# EAGLE board ME461_F28379D (EAGLE 7.7.0), part 1 of 3
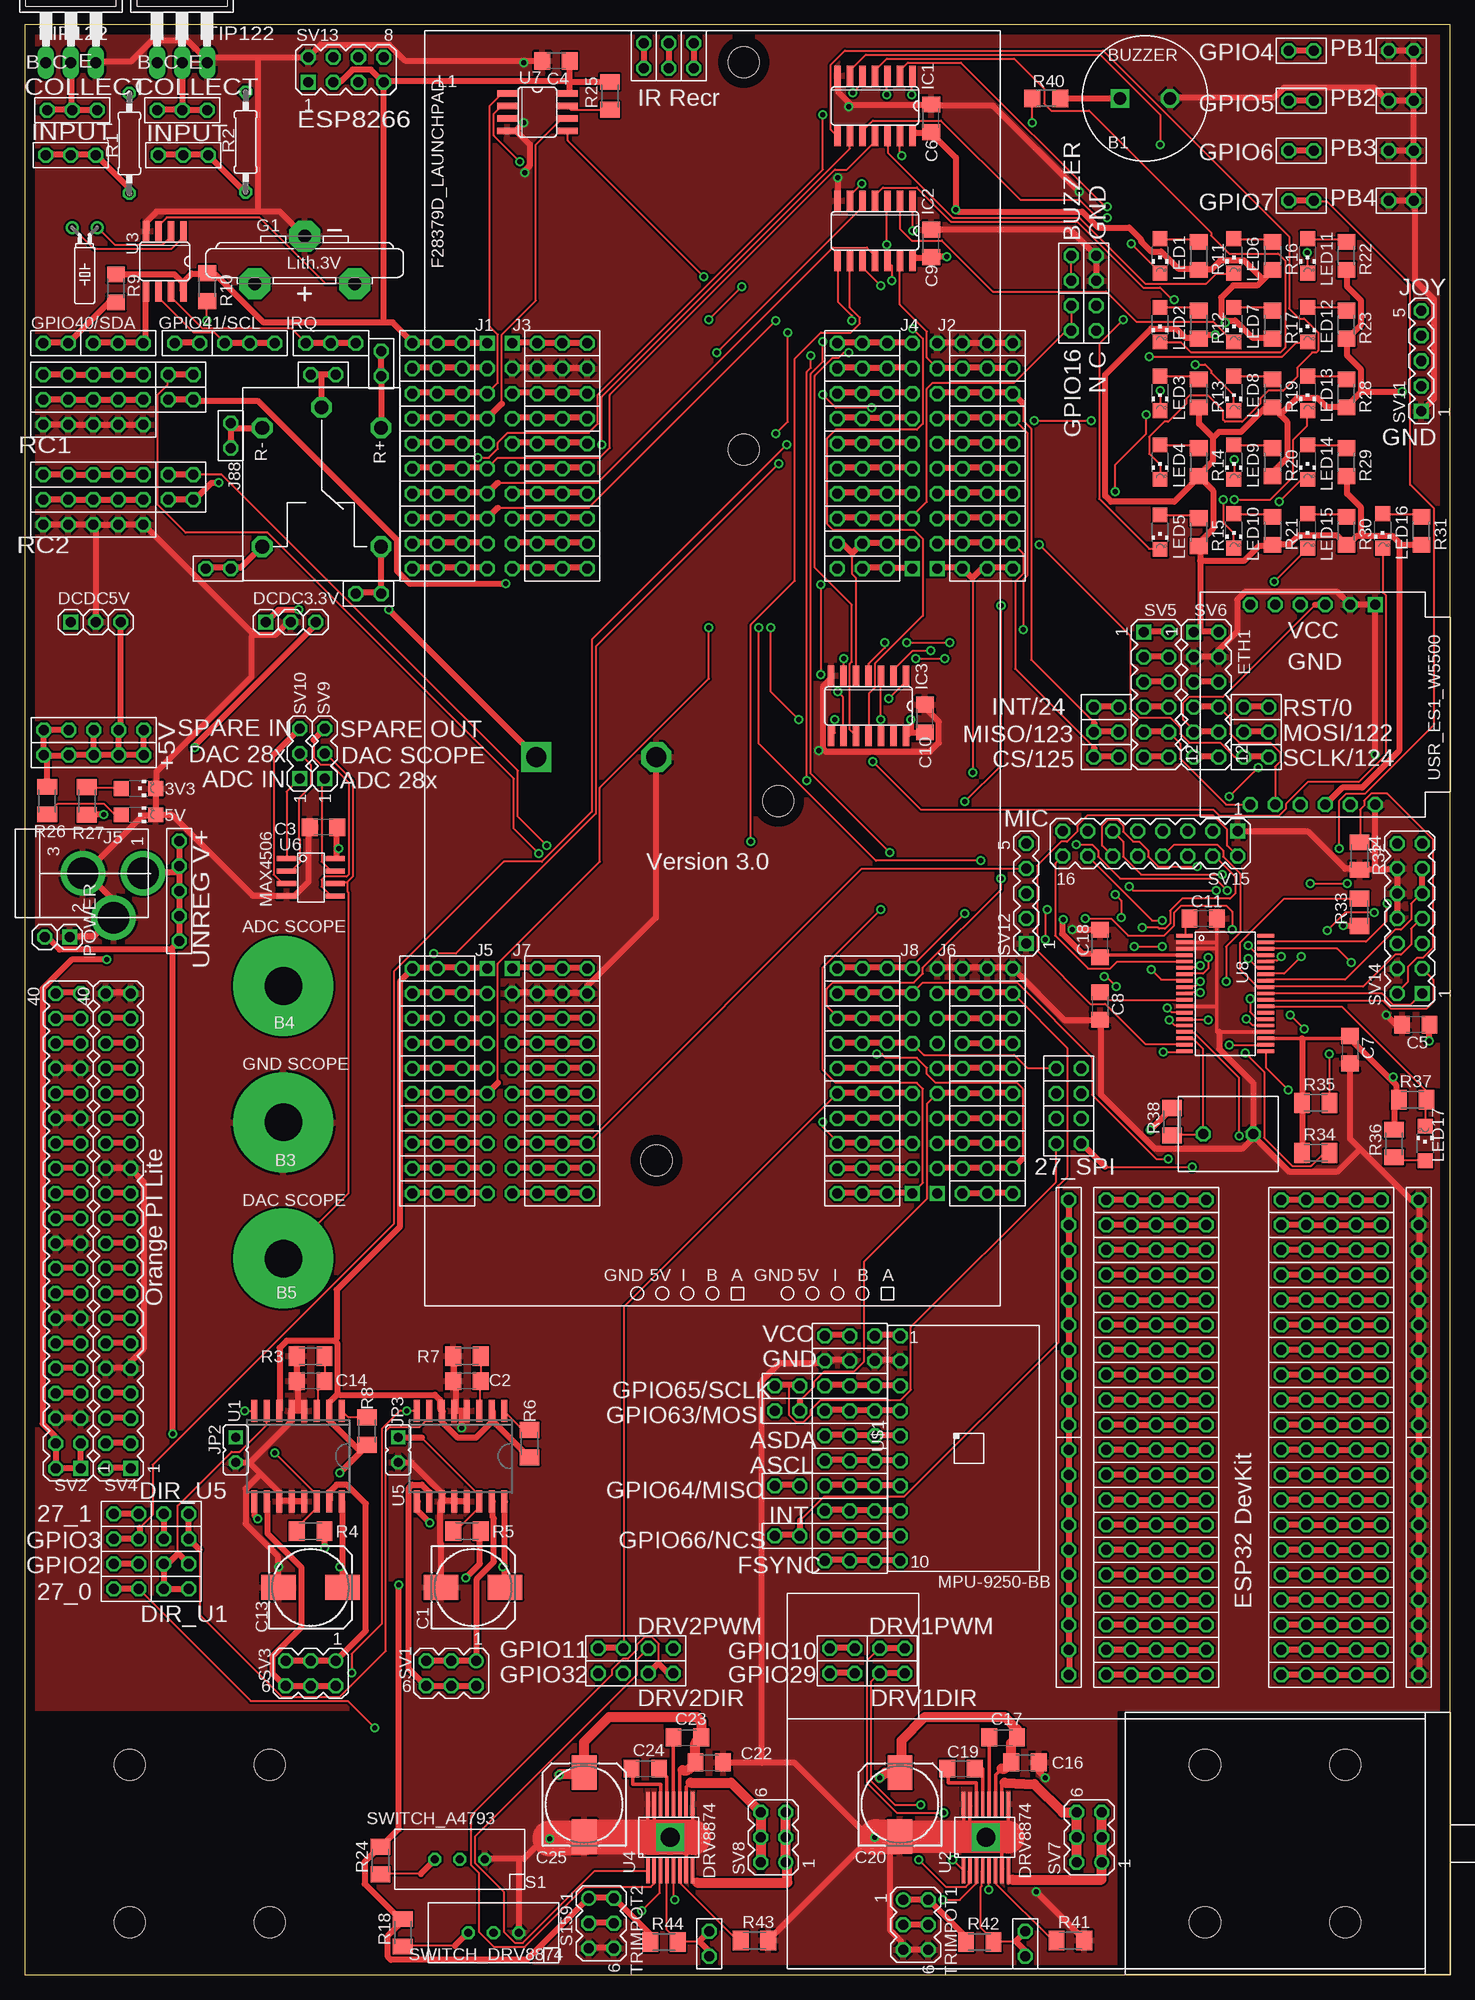
[diagram p5: board, top side]
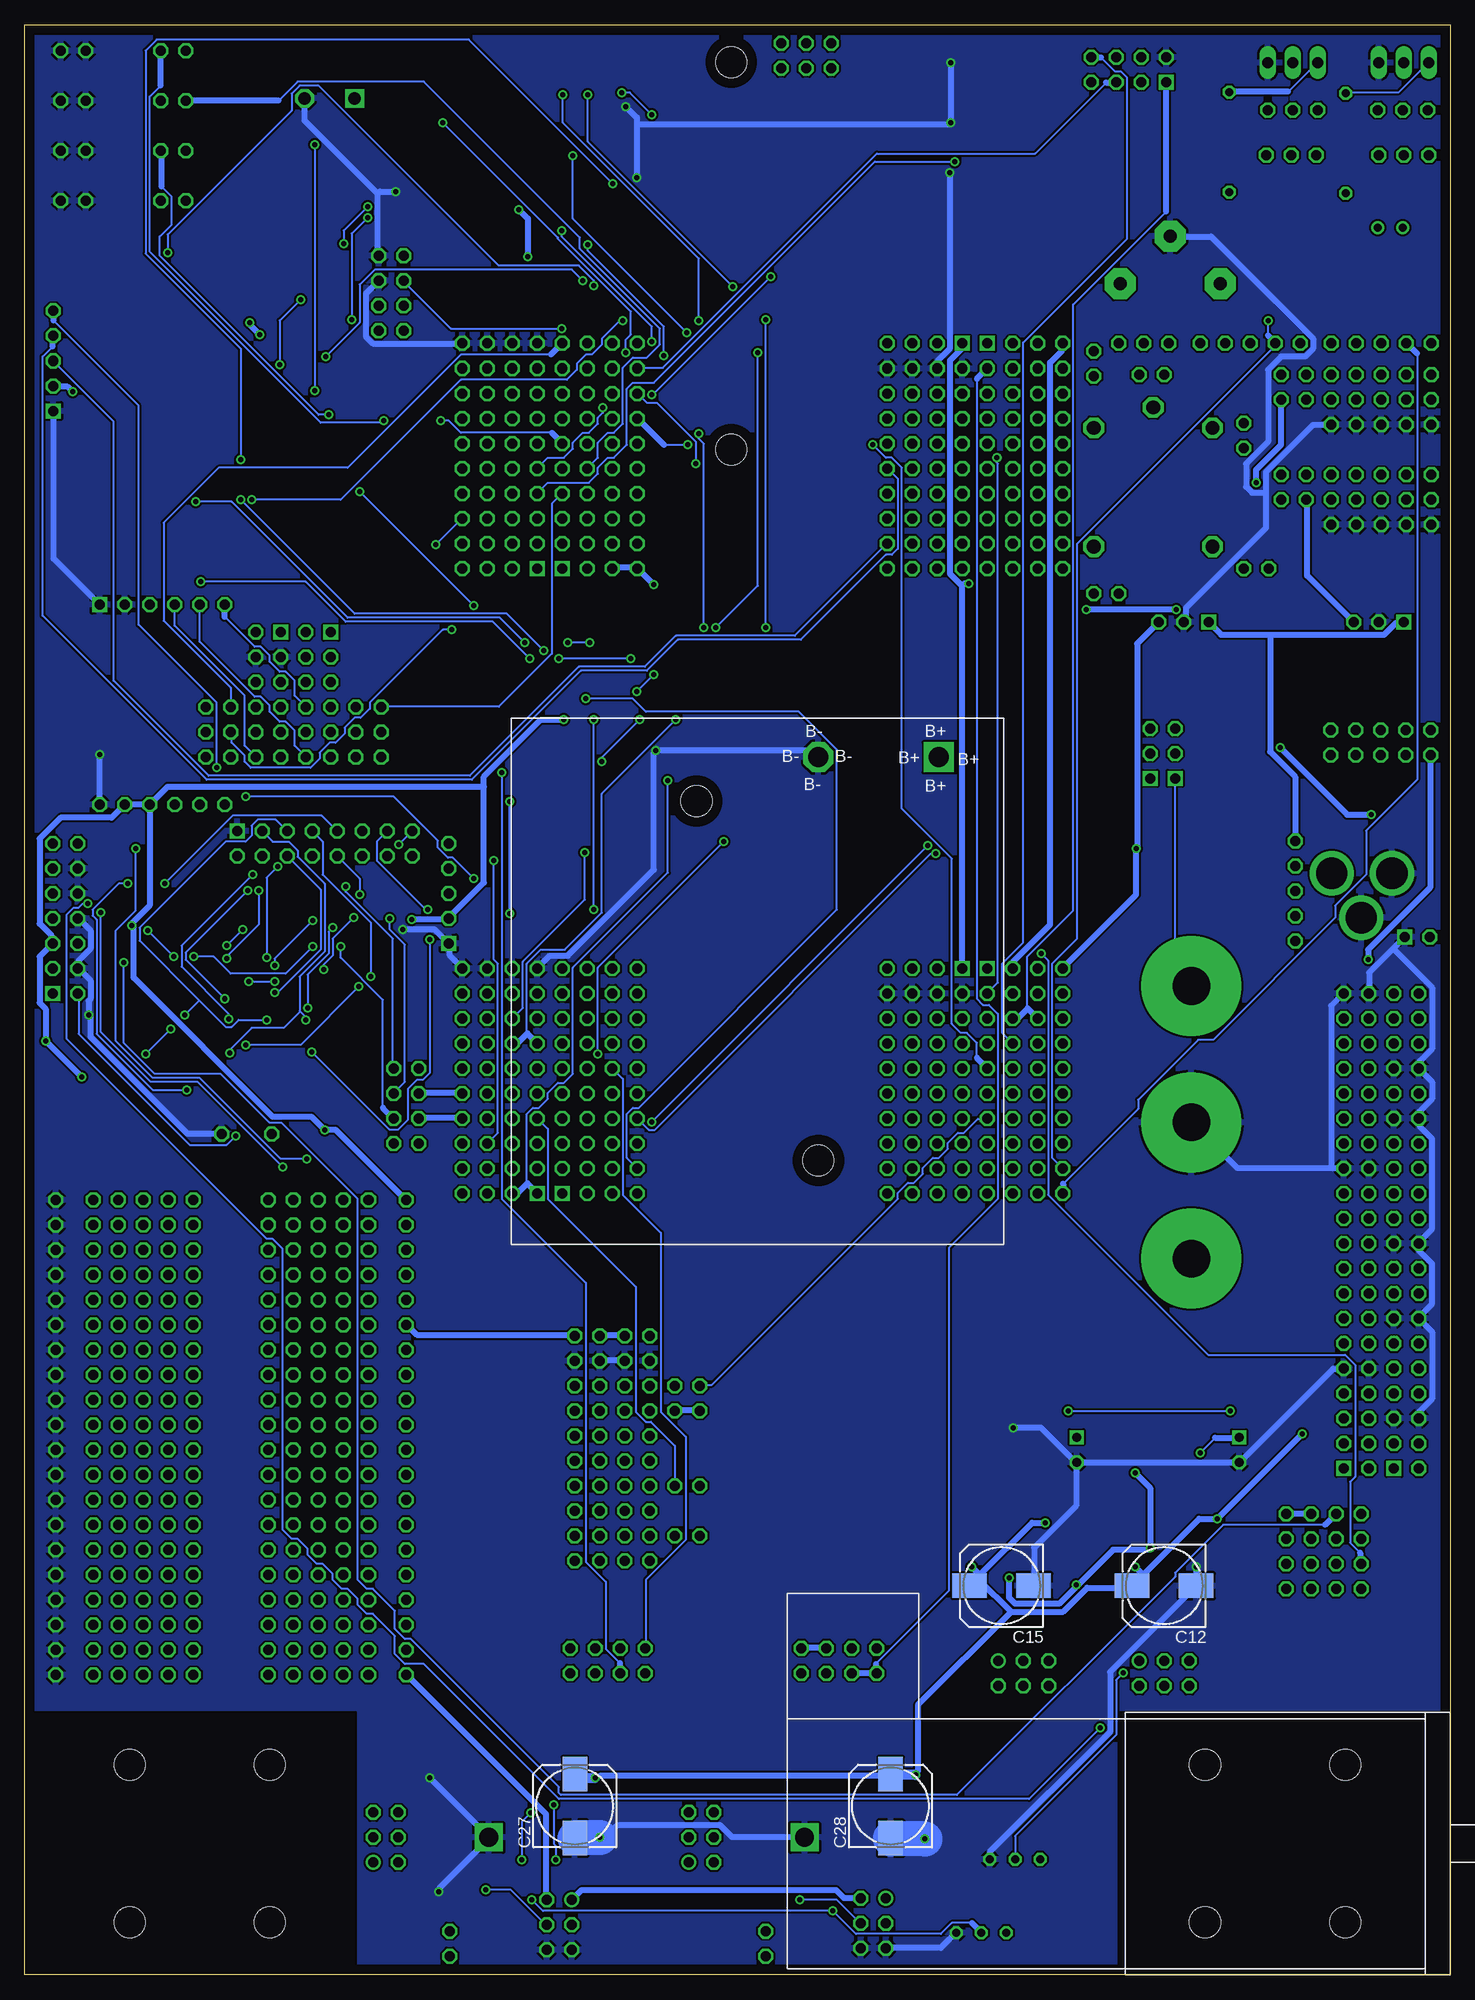
[diagram p6: board, bottom side, seen from below]

Size 144.78 x 198.12 mm. Coordinates in mm from the lower left corner, seen from the top.
Outline: 0,0 144.78,0 144.78,198.12 0,198.12 0,0
Copper layers (1*16): Top 0.035mm / dielectric 1.5mm / Bottom 0.035mm
Design rules "default *": minimum track width 7mil, minimum drill 20mil, track to track 8mil, track to pad 8mil, pad to pad 8mil, via to via 8mil, smd to smd 8mil, copper to edge 40mil, drill to drill 8mil, minimum pad ring 10mil, minimum via ring 8mil, stop-mask expansion 4mil, vias tented up to drill 20mil, thermal gap 10mil
Net classes: 0 default: width 0.203 mm, drill 0.508 mm, clearance 0.203 mm; 1 supply: width 0.61 mm, drill 0.508 mm, clearance 0.203 mm
tRestrict: area 0,0 to 33.7,26.7; area 111.1,0 to 144.8,26.7
bRestrict: area 111.1,0 to 144.8,26.7; area 0,0 to 33.7,26.7

## Footprints (pad centres in the part's own frame; a part is rotated, then mirrored left to right if it is on the bottom)
CHIPLED_1206 = smd 1.5 x 1.5: A 0,-1.75; C 0,1.75
BUZZER = drill 1.27 square: P$1 -2.54,0 | drill 1.27 octagon: P$2 2.54,0
BATTERY_4AA_HOLDER = drill 2.032 square: P$1 0,0 | drill 2.032 octagon: P$2 12.224,0 | hole 3.175: 12.224,40.958; 24.606,4.445
BANANA_MALE = drill 3.81 pad 10.16: P$1 0,0
153CLV-0810 = smd 3.5 x 2.5: + 3.25,0; - -3.25,0
C1206 = smd 1.6 x 1.8: 1 -1.4,0; 2 1.4,0
1X03 = drill 1.016 square: 1 -2.54,0 | drill 1.016 octagon: 2 0,0; 3 2.54,0
USR_ES1_W5500 = drill 1.016 square: P$1 0,0 | drill 1.016 octagon: P$2 0,-2.54; P$3 0,-5.08; P$4 0,-7.62; P$5 0,-10.16; P$6 0,-12.7; P$7 20.32,-12.7; P$8 20.32,-10.16; P$9 20.32,-7.62; P$10 20.32,-5.08; P$11 20.32,-2.54; P$12 20.32,0
CR2032V = drill 1.321 pad 3.15 octagon: + -2.54,-5.08; +@1 -2.54,5.08; - 2.286,0
SO14 = smd 0.66 x 2.032: 1 -3.81,-3.073; 2 -2.54,-3.073; 3 -1.27,-3.073; 4 0,-3.073; 5 1.27,-3.073; 6 2.54,-3.073; 7 3.81,-3.073; 8 3.81,3.073; 9 2.54,3.073; 10 1.27,3.073; 11 0,3.073; 12 -1.27,3.073; 13 -2.54,3.073; 14 -3.81,3.073
STRIP3 = drill 1.016 octagon: P$1 0,0; P$2 2.54,0; P$3 5.08,0
JACK-PMS = drill 3.175 pad 4.5: 1 -0.5,-3.31; 2 -5,-0.31; 3 -0.5,2.809
STRIP2 = drill 1.016 octagon: P$1 0,0; P$2 2.54,0
RELAY_JQC-3F_5V = drill 1.397 octagon: P$1 0,0; P$2 2.064,6.032; P$3 14.129,6.032; P$4 14.129,-6.032; P$5 2.064,-6.032
JP1 = drill 0.914 square: 1 0,-1.27 | drill 0.914 octagon: 2 0,1.27
F28379D_LAUNCHPAD = drill 1.016 square: P$1 -24.13,33.02; P$11 21.59,10.16; P$21 -21.59,33.02; P$31 19.05,10.16; P$41 -24.13,-30.48; P$51 21.59,-53.34; P$61 -21.59,-30.48; P$71 19.05,-53.34 | drill 1.016 octagon: P$2 -24.13,30.48; P$3 -24.13,27.94; P$4 -24.13,25.4; P$5 -24.13,22.86; P$6 -24.13,20.32; P$7 -24.13,17.78; P$8 -24.13,15.24; P$9 -24.13,12.7; P$10 -24.13,10.16; P$12 21.59,12.7; P$13 21.59,15.24; P$14 21.59,17.78; P$15 21.59,20.32; P$16 21.59,22.86; P$17 21.59,25.4; P$18 21.59,27.94; P$19 21.59,30.48; P$20 21.59,33.02; P$22 -21.59,30.48; P$23 -21.59,27.94; P$24 -21.59,25.4; P$25 -21.59,22.86; P$26 -21.59,20.32; P$27 -21.59,17.78; P$28 -21.59,15.24; P$29 -21.59,12.7; P$30 -21.59,10.16; P$32 19.05,12.7; P$33 19.05,15.24; P$34 19.05,17.78; P$35 19.05,20.32; P$36 19.05,22.86; P$37 19.05,25.4; P$38 19.05,27.94; P$39 19.05,30.48; P$40 19.05,33.02; P$42 -24.13,-33.02; P$43 -24.13,-35.56; P$44 -24.13,-38.1; P$45 -24.13,-40.64; P$46 -24.13,-43.18; P$47 -24.13,-45.72; P$48 -24.13,-48.26; P$49 -24.13,-50.8; P$50 -24.13,-53.34; P$52 21.59,-50.8; P$53 21.59,-48.26; P$54 21.59,-45.72; P$55 21.59,-43.18; P$56 21.59,-40.64; P$57 21.59,-38.1; P$58 21.59,-35.56; P$59 21.59,-33.02; P$60 21.59,-30.48; P$62 -21.59,-33.02; P$63 -21.59,-35.56; P$64 -21.59,-38.1; P$65 -21.59,-40.64; P$66 -21.59,-43.18; P$67 -21.59,-45.72; P$68 -21.59,-48.26; P$69 -21.59,-50.8; P$70 -21.59,-53.34; P$72 19.05,-50.8; P$73 19.05,-48.26; P$74 19.05,-45.72; P$75 19.05,-43.18; P$76 19.05,-40.64; P$77 19.05,-38.1; P$78 19.05,-35.56; P$79 19.05,-33.02; P$80 19.05,-30.48
TH_PUSHBUTTON = drill 1.016 octagon: 1 0,2.54; 2 0,-2.54
1X02 = drill 1.016 square: 1 -1.27,0 | drill 1.016 octagon: 2 1.27,0
TC26H = drill 0.813: 1 -1.27,0; 2 1.27,0
0207/10 = drill 0.813 octagon: 1 -5.08,0; 2 5.08,0
M1206 = smd 1.6 x 2: 1 -1.4,0; 2 1.4,0
R1206 = smd 1.6 x 1.803: 1 -1.422,0; 2 1.422,0
SWITCH_SLIDE = drill 0.813 octagon: P$1 0,-5.08; P$2 0,-2.54; P$3 0,0
STRIP5 = drill 1.016 octagon: P$1 0,0; P$2 2.54,0; P$3 5.08,0; P$4 7.62,0; P$5 10.16,0
STRIP10 = drill 1.016 octagon: P$1 0,0; P$2 2.54,0; P$3 5.08,0; P$4 7.62,0; P$5 10.16,0; P$6 12.7,0; P$7 15.24,0; P$8 17.78,0; P$9 20.32,0; P$10 22.86,0
MA03-2 = drill 1.016: 1 -2.54,-1.27 | drill 1.016 octagon: 2 -2.54,1.27; 3 0,-1.27; 4 0,1.27; 5 2.54,-1.27; 6 2.54,1.27
MA20-2 = drill 1.016 square: 1 -24.13,-1.27 | drill 1.016 octagon: 2 -24.13,1.27; 3 -21.59,-1.27; 4 -21.59,1.27; 5 -19.05,-1.27; 6 -19.05,1.27; 7 -16.51,-1.27; 8 -16.51,1.27; 9 -13.97,-1.27; 10 -13.97,1.27; 11 -11.43,-1.27; 12 -11.43,1.27; 13 -8.89,-1.27; 14 -8.89,1.27; 15 -6.35,-1.27; 16 -6.35,1.27; 17 -3.81,-1.27; 18 -3.81,1.27; 19 -1.27,-1.27; 20 -1.27,1.27; 21 1.27,-1.27; 22 1.27,1.27; 23 3.81,-1.27; 24 3.81,1.27; 25 6.35,-1.27; 26 6.35,1.27; 27 8.89,-1.27; 28 8.89,1.27; 29 11.43,-1.27; 30 11.43,1.27; 31 13.97,-1.27; 32 13.97,1.27; 33 16.51,-1.27; 34 16.51,1.27; 35 19.05,-1.27; 36 19.05,1.27; 37 21.59,-1.27; 38 21.59,1.27; 39 24.13,-1.27; 40 24.13,1.27
MA06-2 = drill 1.016 square: 1 -6.35,-1.27 | drill 1.016 octagon: 2 -6.35,1.27; 3 -3.81,-1.27; 4 -3.81,1.27; 5 -1.27,-1.27; 6 -1.27,1.27; 7 1.27,-1.27; 8 1.27,1.27; 9 3.81,-1.27; 10 3.81,1.27; 11 6.35,-1.27; 12 6.35,1.27
MA03-1 = drill 1.016 square: 1 -2.54,0 | drill 1.016 octagon: 2 0,0; 3 2.54,0
MA05-1 = drill 1.016 square: 1 -5.08,0 | drill 1.016 octagon: 2 -2.54,0; 3 0,0; 4 2.54,0; 5 5.08,0
MA04-2 = drill 1.016 square: 1 -3.81,-1.27 | drill 1.016 octagon: 2 -3.81,1.27; 3 -1.27,-1.27; 4 -1.27,1.27; 5 1.27,-1.27; 6 1.27,1.27; 7 3.81,-1.27; 8 3.81,1.27
MA07-2 = drill 1.016 square: 1 -7.62,-1.27 | drill 1.016 octagon: 2 -7.62,1.27; 3 -5.08,-1.27; 4 -5.08,1.27; 5 -2.54,-1.27; 6 -2.54,1.27; 7 0,-1.27; 8 0,1.27; 9 2.54,-1.27; 10 2.54,1.27; 11 5.08,-1.27; 12 5.08,1.27; 13 7.62,-1.27; 14 7.62,1.27
MA08-2 = drill 1.016 square: 1 -8.89,-1.27 | drill 1.016 octagon: 2 -8.89,1.27; 3 -6.35,-1.27; 4 -6.35,1.27; 5 -3.81,-1.27; 6 -3.81,1.27; 7 -1.27,-1.27; 8 -1.27,1.27; 9 1.27,-1.27; 10 1.27,1.27; 11 3.81,-1.27; 12 3.81,1.27; 13 6.35,-1.27; 14 6.35,1.27; 15 8.89,-1.27; 16 8.89,1.27
TO220 = drill 1.118 long: 1 -2.54,-6.35; 2 0,-6.35; 3 2.54,-6.35
SO16W = smd 0.6 x 2.2: 1 -4.445,-4.6; 2 -3.175,-4.6; 3 -1.905,-4.6; 4 -0.635,-4.6; 5 0.635,-4.6; 6 1.905,-4.6; 7 3.175,-4.6; 8 4.445,-4.6; 9 4.445,4.6; 10 3.175,4.6; 11 1.905,4.6; 12 0.635,4.6; 13 -0.635,4.6; 14 -1.905,4.6; 15 -3.175,4.6; 16 -4.445,4.6
HTSSOP16 = smd 2.5 x 0.35: P$1 -3.4,2.275; P$2 -3.4,1.625; P$3 -3.4,0.975; P$4 -3.4,0.325; P$5 -3.4,-0.325; P$6 -3.4,-0.975; P$7 -3.4,-1.625; P$8 -3.4,-2.275; P$9 3.4,-2.275; P$10 3.4,-1.625; P$11 3.4,-0.975; P$12 3.4,-0.325; P$13 3.4,0.325; P$14 3.4,0.975; P$15 3.4,1.625; P$16 3.4,2.275 | drill 1.905 pad 2.54 square: P$17 0,0
SO08 = smd 0.66 x 2.032: 1 -1.905,-3.073; 2 -0.635,-3.073; 3 0.635,-3.073; 4 1.905,-3.073; 5 1.905,3.073; 6 0.635,3.073; 7 -0.635,3.073; 8 -1.905,3.073
SOIC-8 = smd 1.98 x 0.53: P$1 -2.465,1.905; P$2 -2.465,0.635; P$3 -2.465,-0.635; P$4 -2.465,-1.905; P$5 2.465,-1.905; P$6 2.465,-0.635; P$7 2.465,0.635; P$8 2.465,1.905
DA38 = smd 0.35 x 1.705: 1 -5.85,-4.12; 2 -5.2,-4.12; 3 -4.55,-4.12; 4 -3.9,-4.12; 5 -3.25,-4.12; 6 -2.6,-4.12; 7 -1.95,-4.12; 8 -1.3,-4.12; 9 -0.65,-4.12; 10 0,-4.12; 11 0.65,-4.12; 12 1.3,-4.12; 13 1.95,-4.12; 14 2.6,-4.12; 15 3.25,-4.12; 16 3.9,-4.12; 17 4.55,-4.12; 18 5.2,-4.12; 19 5.85,-4.12; 20 5.85,4.12; 21 5.2,4.12; 22 4.55,4.12; 23 3.9,4.12; 24 3.25,4.12; 25 2.6,4.12; 26 1.95,4.12; 27 1.3,4.12; 28 0.65,4.12; 29 0,4.12; 30 -0.65,4.12; 31 -1.3,4.12; 32 -1.95,4.12; 33 -2.6,4.12; 34 -3.25,4.12; 35 -3.9,4.12; 36 -4.55,4.12; 37 -5.2,4.12; 38 -5.85,4.12
MPU-9250-BB = drill 1.016 octagon: 1 -11.434,-6.96; 2 -8.894,-6.96; 3 -6.354,-6.96; 4 -3.814,-6.96; 5 -1.274,-6.96; 6 1.266,-6.96; 7 3.806,-6.96; 8 6.346,-6.96; 9 8.886,-6.96; 10 11.426,-6.96
GEARMOTOR_MOUNT = hole 3.175: 7.112,8.001; -7.112,8.001; -7.112,-8.001; 7.112,-8.001
CASTERWHEEL = hole 3.175: 19.685,0; -19.685,0

## Placement (x,y rotation side)
3V3  [CHIPLED_1206]  11.56,120.52 270 top
5V  [CHIPLED_1206]  11.56,117.86 270 top
B1  BUZZER  [BUZZER]  113.79,190.63 0 top
B2  BATTERY_4AA_HOLDER  [BATTERY_4AA_HOLDER]  51.94,123.7 180 bottom
B3  GND SCOPE  [BANANA_MALE]  26.29,86.61 0 top
B4  ADC SCOPE  [BANANA_MALE]  26.29,100.46 0 top
B5  DAC SCOPE  [BANANA_MALE]  26.29,72.77 0 top
C1  47uF  [153CLV-0810]  45.56,39.36 0 top
C2  680pF  [C1206]  44.92,60.32 180 top
C3  0.1uf  [C1206]  30.35,116.59 180 top
C4  0.1uf  [C1206]  53.98,194.44 180 top
C5  0.1 uF  [C1206]  141.29,96.52 180 top
C6  0.1uf  [C1206]  92.08,188.59 90 top
C7  2.2 uF  [C1206]  134.62,93.98 270 top
C8  2.2 uF  [C1206]  109.22,98.42 270 top
C9  0.1uf  [C1206]  92.08,175.9 90 top
C10  0.1uf  [C1206]  91.44,127.64 90 top
C11  2.2 uF  [C1206]  119.7,107.31 0 top
C12  47uF  [153CLV-0810]  29.05,39.53 180 bottom
C13  47uF  [153CLV-0810]  29.05,39.36 0 top
C14  680pF  [C1206]  29.05,60.32 180 top
C15  47uF  [153CLV-0810]  45.56,39.53 180 bottom
C16  0.1uF  [C1206]  101.6,21.59 0 top
C17  0.1uF  [C1206]  99.38,24.13 0 top
C18  2.2 uF  [C1206]  109.22,104.78 90 top
C19  22nF  [C1206]  95.09,20.95 0 top
C20  47uF  [153CLV-0810]  88.9,17.3 90 top
C22  0.1uF  [C1206]  69.53,21.59 0 top
C23  0.1uF  [C1206]  67.31,24.13 0 top
C24  22nF  [C1206]  63.02,20.95 0 top
C25  47uF  [153CLV-0810]  56.83,17.3 90 top
C27  47uF  [153CLV-0810]  88.9,17.14 90 bottom
C28  47uF  [153CLV-0810]  56.83,17.14 90 bottom
DCDC3.3V  [1X03]  27.05,137.41 0 top
DCDC5V  [1X03]  7.24,137.41 0 top
ETH1  USR_ES1_W5500  [USR_ES1_W5500]  137.16,139.19 270 top
G1  CR2032V  [CR2032V]  28.44,174.33 90 top
IC1  7404D  [SO14]  86.36,189.87 180 top
IC2  7404D  [SO14]  86.36,177.16 180 top
IC3  7404D  [SO14]  85.72,128.91 180 top
J1  STRIP3  [STRIP3]  28.57,165.74 0 top
J2  STRIP3  [STRIP3]  20.32,165.74 0 top
J3  STRIP3  [STRIP3]  6.99,165.74 0 top
J4  STRIP3  [STRIP3]  2.28,189.45 0 top
J5  [JACK-PMS]  8.72,112.4 90 top
J6  STRIP3  [STRIP3]  2.15,184.87 0 top
J7  STRIP2  [STRIP2]  108.84,172.09 90 top
J8  STRIP2  [STRIP2]  108.84,167 90 top
J9  STRIP2  [STRIP2]  108.58,128.78 0 top
J10  STRIP3  [STRIP3]  39.37,165.74 0 top
J11  STRIP2  [STRIP2]  123.83,128.78 0 top
J12  STRIP2  [STRIP2]  62.87,193.68 90 top
J13  STRIP2  [STRIP2]  65.41,193.68 90 top
J14  STRIP3  [STRIP3]  39.37,163.19 0 top
J15  STRIP3  [STRIP3]  39.37,160.66 0 top
J16  STRIP3  [STRIP3]  39.37,158.12 0 top
J17  STRIP3  [STRIP3]  39.37,155.57 0 top
J18  STRIP3  [STRIP3]  39.37,153.03 0 top
J19  STRIP3  [STRIP3]  39.37,150.5 0 top
J20  STRIP3  [STRIP3]  39.37,147.96 0 top
J21  STRIP3  [STRIP3]  39.37,145.41 0 top
J22  STRIP2  [STRIP2]  67.94,193.68 90 top
J23  STRIP3  [STRIP3]  13.46,189.45 0 top
J24  STRIP3  [STRIP3]  13.58,184.87 0 top
J25  STRIP2  [STRIP2]  14.13,39.21 0 top
J26  STRIP2  [STRIP2]  9.05,39.21 0 top
J27  STRIP2  [STRIP2]  9.05,46.83 0 top
J28  STRIP3  [STRIP3]  39.37,142.88 0 top
J29  STRIP3  [STRIP3]  95.25,142.88 0 top
J30  STRIP3  [STRIP3]  95.25,145.41 0 top
J31  STRIP3  [STRIP3]  95.25,147.96 0 top
J32  STRIP3  [STRIP3]  95.25,150.5 0 top
J33  STRIP3  [STRIP3]  95.25,153.03 0 top
J34  STRIP2  [STRIP2]  14.13,46.83 0 top
J35  STRIP2  [STRIP2]  107.31,87 180 top
J36  STRIP2  [STRIP2]  107.31,89.53 180 top
J37  STRIP2  [STRIP2]  107.31,92.08 180 top
J38  STRIP2  [STRIP2]  107.31,84.45 180 top
J66  STRIP2  [STRIP2]  123.83,126.24 0 top
J67  STRIP2  [STRIP2]  108.58,126.24 0 top
J68  STRIP2  [STRIP2]  123.83,123.7 0 top
J69  STRIP2  [STRIP2]  108.58,123.7 0 top
J70  STRIP2  [STRIP2]  141.1,195.45 180 top
J71  STRIP2  [STRIP2]  130.94,195.45 180 top
J72  STRIP2  [STRIP2]  141.1,190.37 180 top
J73  STRIP2  [STRIP2]  130.94,190.37 180 top
J74  STRIP2  [STRIP2]  141.1,185.29 180 top
J75  STRIP2  [STRIP2]  130.94,185.29 180 top
J76  STRIP2  [STRIP2]  141.1,180.21 180 top
J77  STRIP2  [STRIP2]  130.94,180.21 180 top
J78  STRIP2  [STRIP2]  101.6,4.45 270 top
J79  STRIP2  [STRIP2]  86.84,33.18 0 top
J80  STRIP2  [STRIP2]  86.84,30.64 0 top
J81  STRIP2  [STRIP2]  69.53,4.45 270 top
J82  STRIP2  [STRIP2]  63.34,33.18 0 top
J83  STRIP2  [STRIP2]  63.34,30.64 0 top
J84  STRIP2  [STRIP2]  81.76,33.18 0 top
J85  STRIP2  [STRIP2]  81.76,30.64 0 top
J86  STRIP2  [STRIP2]  58.26,33.18 0 top
J87  STRIP2  [STRIP2]  58.26,30.64 0 top
J88  RELAY_JQC-3F_5V  [RELAY_JQC-3F_5V]  30.16,159.23 270 top
J89  STRIP2  [STRIP2]  36.2,164.94 270 top
J90  STRIP2  [STRIP2]  20.95,157.64 270 top
J91  STRIP2  [STRIP2]  29.05,162.56 0 top
J92  STRIP2  [STRIP2]  33.66,140.34 0 top
J93  STRIP2  [STRIP2]  18.41,142.88 0 top
J98  STRIP3  [STRIP3]  95.25,155.57 0 top
J99  STRIP3  [STRIP3]  95.25,158.12 0 top
J100  STRIP3  [STRIP3]  95.25,160.66 0 top
J101  STRIP3  [STRIP3]  95.25,163.19 0 top
J102  STRIP3  [STRIP3]  95.25,165.74 0 top
J103  STRIP3  [STRIP3]  52.07,165.74 0 top
J104  STRIP3  [STRIP3]  52.07,163.19 0 top
J105  STRIP3  [STRIP3]  52.07,160.66 0 top
J106  STRIP3  [STRIP3]  52.07,158.12 0 top
J107  STRIP3  [STRIP3]  52.07,155.57 0 top
J108  STRIP3  [STRIP3]  52.07,153.03 0 top
J109  STRIP3  [STRIP3]  52.07,150.5 0 top
J110  STRIP3  [STRIP3]  52.07,147.96 0 top
J111  STRIP3  [STRIP3]  52.07,145.41 0 top
J112  STRIP3  [STRIP3]  52.07,142.88 0 top
J113  STRIP3  [STRIP3]  82.55,142.88 0 top
J114  STRIP3  [STRIP3]  82.55,145.41 0 top
J115  STRIP3  [STRIP3]  82.55,147.96 0 top
J116  STRIP3  [STRIP3]  82.55,150.5 0 top
J117  STRIP3  [STRIP3]  82.55,153.03 0 top
J118  STRIP3  [STRIP3]  82.55,155.57 0 top
J119  STRIP3  [STRIP3]  82.55,158.12 0 top
J120  STRIP3  [STRIP3]  82.55,160.66 0 top
J121  STRIP3  [STRIP3]  82.55,163.19 0 top
J122  STRIP3  [STRIP3]  82.55,165.74 0 top
J123  STRIP3  [STRIP3]  81.28,64.93 0 top
J124  STRIP3  [STRIP3]  81.28,62.39 0 top
J125  STRIP3  [STRIP3]  81.28,59.85 0 top
J126  STRIP3  [STRIP3]  81.28,57.31 0 top
J127  STRIP3  [STRIP3]  81.28,54.77 0 top
J128  STRIP3  [STRIP3]  81.28,52.23 0 top
J129  STRIP3  [STRIP3]  81.28,49.69 0 top
J130  STRIP3  [STRIP3]  81.28,47.15 0 top
J131  STRIP3  [STRIP3]  81.28,44.61 0 top
J132  STRIP3  [STRIP3]  81.28,42.07 0 top
J133  STRIP3  [STRIP3]  82.55,102.23 0 top
J134  STRIP3  [STRIP3]  82.55,99.69 0 top
J135  STRIP3  [STRIP3]  82.55,97.16 0 top
J136  STRIP3  [STRIP3]  82.55,94.61 0 top
J137  STRIP3  [STRIP3]  82.55,92.08 0 top
J138  STRIP3  [STRIP3]  82.55,89.53 0 top
J139  STRIP3  [STRIP3]  82.55,87 0 top
J140  STRIP3  [STRIP3]  82.55,84.45 0 top
J141  STRIP3  [STRIP3]  82.55,81.92 0 top
J142  STRIP3  [STRIP3]  82.55,79.38 0 top
J143  STRIP3  [STRIP3]  52.07,79.38 0 top
J144  STRIP3  [STRIP3]  52.07,81.92 0 top
J145  STRIP3  [STRIP3]  52.07,84.45 0 top
J146  STRIP3  [STRIP3]  52.07,87 0 top
J147  STRIP3  [STRIP3]  52.07,89.53 0 top
J148  STRIP3  [STRIP3]  52.07,92.08 0 top
J149  STRIP3  [STRIP3]  52.07,94.61 0 top
J150  STRIP3  [STRIP3]  52.07,97.16 0 top
J151  STRIP3  [STRIP3]  52.07,99.69 0 top
J152  STRIP3  [STRIP3]  52.07,102.23 0 top
J153  STRIP3  [STRIP3]  95.25,102.23 0 top
J154  STRIP3  [STRIP3]  95.25,99.69 0 top
J155  STRIP3  [STRIP3]  95.25,97.16 0 top
J156  STRIP3  [STRIP3]  95.25,94.61 0 top
J157  STRIP3  [STRIP3]  95.25,92.08 0 top
J158  STRIP3  [STRIP3]  95.25,89.53 0 top
J159  STRIP3  [STRIP3]  95.25,87 0 top
J160  STRIP3  [STRIP3]  95.25,84.45 0 top
J161  STRIP3  [STRIP3]  95.25,81.92 0 top
J162  STRIP3  [STRIP3]  95.25,79.38 0 top
J163  STRIP3  [STRIP3]  39.37,79.38 0 top
J164  STRIP3  [STRIP3]  39.37,81.92 0 top
J165  STRIP3  [STRIP3]  39.37,84.45 0 top
J166  STRIP3  [STRIP3]  39.37,87 0 top
J167  STRIP3  [STRIP3]  39.37,89.53 0 top
J168  STRIP3  [STRIP3]  39.37,92.08 0 top
J169  STRIP3  [STRIP3]  39.37,94.61 0 top
J170  STRIP3  [STRIP3]  39.37,97.16 0 top
J176  STRIP3  [STRIP3]  39.37,99.69 0 top
J177  STRIP3  [STRIP3]  39.37,102.23 0 top
J194  STRIP2  [STRIP2]  106.3,172.09 90 top
J196  STRIP2  [STRIP2]  14.13,41.75 0 top
J197  STRIP2  [STRIP2]  14.13,44.29 0 top
J198  STRIP2  [STRIP2]  9.05,41.75 0 top
J199  STRIP2  [STRIP2]  9.05,44.29 0 top
J200  STRIP2  [STRIP2]  14.61,160.02 0 top
J201  STRIP2  [STRIP2]  14.61,162.56 0 top
J202  STRIP2  [STRIP2]  14.61,152.4 0 top
J203  STRIP2  [STRIP2]  14.61,149.86 0 top
J204  STRIP2  [STRIP2]  76.2,57.31 0 top
J205  STRIP2  [STRIP2]  76.2,49.69 0 top
J206  STRIP2  [STRIP2]  76.2,59.85 0 top
J207  STRIP2  [STRIP2]  76.2,44.61 0 top
J208  STRIP2  [STRIP2]  1.91,165.74 0 top
J209  STRIP2  [STRIP2]  15.24,165.74 0 top
J251  STRIP2  [STRIP2]  106.3,167 90 top
JP2  [JP1]  21.43,53.33 180 top
JP3  [JP1]  37.94,53.33 180 top
L1  F28379D_LAUNCHPAD  [F28379D_LAUNCHPAD]  71.12,132.72 0 top
LED1  [CHIPLED_1206]  115.32,174.62 180 top
LED2  [CHIPLED_1206]  115.32,167.64 180 top
LED3  [CHIPLED_1206]  115.32,160.66 180 top
LED4  [CHIPLED_1206]  115.32,153.67 180 top
LED5  [CHIPLED_1206]  115.32,146.56 180 top
LED6  [CHIPLED_1206]  122.81,174.62 180 top
LED7  [CHIPLED_1206]  122.81,167.64 180 top
LED8  [CHIPLED_1206]  122.81,160.66 180 top
LED9  [CHIPLED_1206]  122.81,153.67 180 top
LED10  [CHIPLED_1206]  122.81,146.69 180 top
LED11  [CHIPLED_1206]  130.3,174.62 180 top
LED12  [CHIPLED_1206]  130.3,167.64 180 top
LED13  [CHIPLED_1206]  130.3,160.66 180 top
LED14  [CHIPLED_1206]  130.3,153.67 180 top
LED15  [CHIPLED_1206]  130.3,146.69 180 top
LED16  [CHIPLED_1206]  137.92,146.69 180 top
LED17  [CHIPLED_1206]  142.24,84.45 0 top
P1  [TH_PUSHBUTTON]  122.24,85.41 90 top
POWER  [1X02]  3.33,105.42 180 top
Q1  32.768KHz  [TC26H]  6.09,177.51 180 top
R1  R_B  [0207/10]  10.63,186.06 90 top
R2  R_B  [0207/10]  22.44,186.19 90 top
R3  24.9K  [M1206]  29.05,62.86 0 top
R4  2.2K  [M1206]  29.05,45.08 0 top
R5  2.2K  [M1206]  44.92,45.08 0 top
R6  2.2K  [M1206]  51.27,53.97 270 top
R7  24.9K  [M1206]  44.92,62.86 0 top
R8  2.2K  [M1206]  34.76,55.24 270 top
R9  4.7K  [R1206]  9.27,171.32 270 top
R10  4.7K  [R1206]  18.54,171.45 270 top
R11  [R1206]  119.25,174.62 270 top
R12  [R1206]  119.25,167.64 270 top
R13  [R1206]  119.25,160.66 270 top
R14  [R1206]  119.25,153.67 270 top
R15  [R1206]  119.25,146.56 270 top
R16  [R1206]  126.75,174.62 270 top
R17  [R1206]  126.75,167.64 270 top
R18  2.2K  [M1206]  38.41,4.28 90 top
R19  [R1206]  126.75,160.66 270 top
R20  [R1206]  126.75,153.67 270 top
R21  [R1206]  126.75,146.69 270 top
R22  [R1206]  134.24,174.62 270 top
R23  [R1206]  134.24,167.64 270 top
R24  2.2K  [M1206]  36.13,11.62 90 top
R25  10K  [M1206]  59.44,190.88 90 top
R26  470  [M1206]  2.29,119.29 90 top
R27  470  [M1206]  6.31,119.26 270 top
R28  [R1206]  134.24,160.66 270 top
R29  [R1206]  134.24,153.67 270 top
R30  [R1206]  134.24,146.69 270 top
R31  [R1206]  141.86,146.69 270 top
R32  4.7K  [M1206]  135.57,113.67 270 top
R33  4.7K  [M1206]  135.57,107.95 90 top
R34  4.7k  [M1206]  131.13,83.5 0 top
R35  4.7k  [M1206]  131.13,88.58 0 top
R36  1K  [M1206]  139.06,84.45 90 top
R37  4.7k  [M1206]  140.97,88.9 180 top
R38  4.7k  [M1206]  116.52,86.68 90 top
R40  100  [R1206]  103.76,190.63 0 top
R41  1.8K  [M1206]  106.2,3.49 0 top
R42  10K  [M1206]  97,3.33 0 top
R43  1.8K  [M1206]  74.14,3.49 0 top
R44  10K  [M1206]  64.93,3.33 0 top
S1  SWITCH_A4793  [SWITCH_SLIDE]  41.66,11.75 90 top
S17  STRIP5  [STRIP5]  12.12,123.91 180 top
S18  STRIP5  [STRIP5]  12.12,126.45 180 top
S20  STRIP10  [STRIP10]  141.6,30.48 90 top
S24  STRIP10  [STRIP10]  141.6,55.88 90 top
S53  STRIP10  [STRIP10]  106.05,30.48 90 top
S58  STRIP10  [STRIP10]  106.05,55.88 90 top
S129  STRIP5  [STRIP5]  12.06,157.48 180 top
S130  STRIP5  [STRIP5]  12.06,162.56 180 top
S137  STRIP5  [STRIP5]  12.06,147.32 180 top
S138  STRIP5  [STRIP5]  12.06,152.4 180 top
S139  STRIP5  [STRIP5]  12.06,149.86 180 top
S141  STRIP5  [STRIP5]  15.71,105.03 90 top
S147  STRIP5  [STRIP5]  12.06,160.02 180 top
S159  SWITCH_DRV8874  [SWITCH_SLIDE]  45.08,4.28 90 top
S167  STRIP5  [STRIP5]  109.86,78.74 0 top
S168  STRIP5  [STRIP5]  109.86,76.2 0 top
S169  STRIP5  [STRIP5]  109.86,73.66 0 top
S170  STRIP5  [STRIP5]  109.86,71.12 0 top
S171  STRIP5  [STRIP5]  109.86,68.58 0 top
S172  STRIP5  [STRIP5]  109.86,66.04 0 top
S173  STRIP5  [STRIP5]  109.86,63.5 0 top
S174  STRIP5  [STRIP5]  109.86,60.96 0 top
S175  STRIP5  [STRIP5]  109.86,58.42 0 top
S176  STRIP5  [STRIP5]  109.86,55.88 0 top
S177  STRIP5  [STRIP5]  109.86,53.34 0 top
S178  STRIP5  [STRIP5]  109.86,50.8 0 top
S179  STRIP5  [STRIP5]  109.86,48.26 0 top
S180  STRIP5  [STRIP5]  109.86,45.72 0 top
S181  STRIP5  [STRIP5]  109.86,43.18 0 top
S182  STRIP5  [STRIP5]  109.86,40.64 0 top
S183  STRIP5  [STRIP5]  109.86,38.1 0 top
S184  STRIP5  [STRIP5]  109.86,35.56 0 top
S185  STRIP5  [STRIP5]  109.86,33.02 0 top
S186  STRIP5  [STRIP5]  109.86,30.48 0 top
S187  STRIP5  [STRIP5]  127.64,30.48 0 top
S188  STRIP5  [STRIP5]  127.64,35.56 0 top
S189  STRIP5  [STRIP5]  127.64,33.02 0 top
S210  STRIP5  [STRIP5]  127.64,78.74 0 top
S211  STRIP5  [STRIP5]  127.64,76.2 0 top
S212  STRIP5  [STRIP5]  127.64,73.66 0 top
S213  STRIP5  [STRIP5]  127.64,71.12 0 top
S214  STRIP5  [STRIP5]  127.64,68.58 0 top
S215  STRIP5  [STRIP5]  127.64,66.04 0 top
S216  STRIP5  [STRIP5]  127.64,63.5 0 top
S217  STRIP5  [STRIP5]  127.64,60.96 0 top
S218  STRIP5  [STRIP5]  127.64,58.42 0 top
S219  STRIP5  [STRIP5]  127.64,55.88 0 top
S220  STRIP5  [STRIP5]  127.64,53.34 0 top
S221  STRIP5  [STRIP5]  127.64,50.8 0 top
S222  STRIP5  [STRIP5]  127.64,48.26 0 top
S223  STRIP5  [STRIP5]  127.64,45.72 0 top
S224  STRIP5  [STRIP5]  127.64,43.18 0 top
S225  STRIP5  [STRIP5]  127.64,40.64 0 top
S226  STRIP5  [STRIP5]  127.64,38.1 0 top
SV1  [MA03-2]  43.33,30.63 180 top
SV2  [MA20-2]  4.45,75.56 90 top
SV3  [MA03-2]  29.05,30.63 180 top
SV4  [MA20-2]  9.53,75.56 90 top
SV5  [MA06-2]  114.94,130.05 270 top
SV6  [MA06-2]  120.02,130.05 270 top
SV7  [MA03-2]  108.11,13.97 90 top
SV8  [MA03-2]  76.04,13.97 90 top
SV9  [MA03-1]  30.48,124.08 90 top
SV10  [MA03-1]  27.94,124.08 90 top
SV11  [MA05-1]  141.86,163.96 90 top
SV12  [MA05-1]  101.73,109.86 90 top
SV13  [MA04-2]  32.64,193.55 0 top
SV14  [MA07-2]  140.65,107.31 90 top
SV15  [MA08-2]  114.3,114.94 180 top
T1  TIP125  [TO220]  4.69,200.62 0 top
T2  TIP125  [TO220]  16,200.62 0 top
TRIMPOT1  [MA03-2]  90.49,5.08 270 top
TRIMPOT2  [MA03-2]  58.58,5.24 270 top
U1  A4973  [SO16W]  27.78,52.7 180 top
U2  DRV8874  [HTSSOP16]  97.63,13.97 90 top
U3  BQ32000  [SO08]  14.22,174.08 180 top
U4  DRV8874  [HTSSOP16]  65.56,13.97 90 top
U5  A4973  [SO16W]  44.29,52.7 180 top
U6  MAX4506  [SOIC-8]  29.08,111.51 0 top
U7  IS62WVS512  [SO08]  52.07,189.23 270 top
U8  F28027  [DA38]  121.92,99.69 270 top
U$1  MPU-9250-BB  [MPU-9250-BB]  95.89,53.5 270 top
U$2  GEARMOTOR_MOUNT  [GEARMOTOR_MOUNT]  127,13.34 0 top
U$3  GEARMOTOR_MOUNT  [GEARMOTOR_MOUNT]  17.78,13.34 0 bottom
U$4  CASTERWHEEL  [CASTERWHEEL]  73.03,174.62 90 top

## Tracks (layer width: path | path; a pad name or v marks a point on that pad's centre or on a via)
28027_GPIO0  (via drill 0.51)
  Top 0.203: v138.38,108.81 138.28,108.71 138.28,106.98 136.25,104.95 126.09,104.95 U8.37 | v35.56,25.09 32.82,27.84 22.96,27.84 J26.P$2 | 9.14,39.22 J26.P$1
  Top 0.61: J26.P$2 9.14,39.22
  Bottom 0.203: v138.38,108.81 138.89,108.81 139.29,108.41 139.8,108.41 140.51,107.7 140.51,95.1 120.19,74.78 119.58,74.78 118.57,73.76 118.57,45.21 117.65,44.3 117.04,44.3 116.03,43.28 116.03,42.67 115.11,41.76 114.5,41.76 113.49,40.74 113.49,40.13 112.57,39.22 111.96,39.22 110.95,38.2 110.95,37.59 110.03,36.68 109.42,36.68 107.19,34.44 107.19,32.61 106.17,31.6 104.24,31.6 90.53,17.88 42.77,17.88 v35.56,25.09
28027_GPIO1  (via drill 0.51)
  Top 0.203: v134.72,102.82 133.3,104.24 126.09,104.24 U8.36 | 9.14,46.84 J27.P$1 | J27.P$2
  Top 0.61: J27.P$2 9.14,46.84
  Bottom 0.203: v134.72,102.82 134.72,94.69 131.57,91.54 124.87,91.54 119.89,86.56 118.67,86.56 110.95,78.84 110.95,40.13 110.03,39.22 109.42,39.22 107.19,36.98 107.19,35.15 106.17,34.14 105.56,34.14 90.53,19.1 90.53,18.49 90.32,18.29 50.09,18.29 27.94,40.44 27.94,40.84 23.06,45.72 12.7,45.72
  Bottom 0.61: J27.P$2 12.7,45.72
28027_GPIO2
  Top 0.203: U8.5 117.75,102.92 110.95,102.92 110.24,102.21 108,102.21 104.65,105.56 104.65,112.88 105.36,113.59 SV15.16
28027_GPIO3  (via drill 0.51)
  Top 0.203: v119.38,102.51 119.18,102.31 117.86,102.31 U8.6 | v115.52,107.09 114.5,107.09 108,113.59 SV15.14
  Bottom 0.203: v119.38,102.51 119.38,103.23 v115.52,107.09
28027_GPIO4  (via drill 0.51)
  Top 0.203: v120.19,103.33 120.19,102.21 119.69,101.7 117.86,101.7 U8.7 | v119.08,112.57 115.11,112.57 114.1,113.59 114.1,114.2 113.18,115.11 112.57,115.11 111.56,116.13 111.56,116.74 110.95,117.35 110.03,117.35 109.42,116.74 109.42,114.71 110.44,113.69 SV15.12
  Bottom 0.203: v120.19,103.33 120.19,111.45 v119.08,112.57
28027_GPIO5  (via drill 0.51)
  Top 0.203: v114.4,102.11 115.42,101.09 117.75,101.09 U8.8 | v111.35,107.39 111.35,109.12 v110.74,109.73
  Bottom 0.203: v114.4,102.11 114.4,102.62 113.49,103.53 113.49,105.26 v111.35,107.39 | v110.74,109.73 110.74,111.35 112.98,113.59 SV15.10
28027_GPIO6  (via drill 0.51)
  Top 0.203: v119.38,100.89 118.87,100.38 117.86,100.38 U8.9 | v122.02,100.89 122.02,104.44 123.44,105.87 123.44,111.86 121.72,113.59 121.72,114.2 121.11,114.81 116.74,114.81 115.62,113.69 SV15.8
  Bottom 0.203: v122.02,100.89 v119.38,100.89
28027_GPIO7  (via drill 0.51)
  Top 0.203: v119.38,99.77 117.86,99.77 U8.10
  Bottom 0.203: v119.38,99.77 119.08,99.77 114.71,104.14 114.71,110.24 118.06,113.59 SV15.6
28027_GPIO12  (via drill 0.51)
  Top 0.203: v116.03,98.25 116.43,97.84 117.75,97.84 U8.13 | v113.49,106.38 115.11,106.38 115.21,106.27 115.82,106.27 116.33,106.78 116.33,108.1 117.55,109.32 122.43,109.32 122.94,109.83 122.94,111.56 120.9,113.59 120.7,113.59 SV15.4
  Bottom 0.203: v116.03,98.25 116.03,101.6 113.89,103.73 113.89,105.97 v113.49,106.38
28027_GPIO34
  Top 0.203: LED17.C 142.24,88.8 142.34,88.9 R37.1 142.24,88.9 142.24,89.92 133.81,98.35 126.09,98.35 U8.27
28027_SCL  (via drill 0.51)
  Top 0.203: v116.23,97.03 116.74,96.52 117.75,96.52 U8.15 | v123.95,93.67 125.88,91.75 125.88,85.04 128.73,82.19 130.66,82.19 131.88,83.41 132.49,83.41 R34.2
  Bottom 0.203: v116.23,97.03 116.23,97.33 116.79,97.89 | 116.79,97.89 116.84,97.94 116.84,101.4 114.3,103.94 114.3,110.85 117.04,113.59 117.04,114.2 117.96,115.11 119.58,115.11 120.6,116.13 SV15.3 | v123.95,93.67 123.95,93.98 121.72,96.22 118.47,96.22 116.79,97.89
28027_SDA  (via drill 0.51)
  Top 0.203: v120.19,97.03 117.86,97.03 U8.14 | v132.49,93.57 132.49,88.59 R35.2 | v128.52,97.54 v129.95,96.11
  Bottom 0.203: v120.19,97.03 123.04,97.03 123.75,96.32 124.36,96.32 127.05,99.01 | 127.05,99.01 133.1,105.05 133.1,106.38 124.36,115.11 122.33,115.11 121.72,115.72 121.72,116.74 121.11,117.35 119.28,117.35 118.16,116.23 SV15.5 | v129.95,96.11 v132.49,93.57 | 127.05,99.01 v128.52,97.54
28027_SPICLKA  (via drill 0.51)
  Top 0.203: v129.64,103.43 127.91,101.7 126.09,101.7 U8.32 | v132.28,106.07 134.11,107.9 v137.06,107.9 | 109.73,82.09 v118.57,82.09 | 107.39,84.43 J38.P$1
  Top 0.61: 107.39,84.43 109.73,82.09
  Bottom 0.203: v132.28,106.07 v129.64,103.43 | v137.06,107.9 137.06,95.81 131.98,90.73 127.2,90.73 v118.57,82.09
28027_SPISIMOA  (via drill 0.51)
  Top 0.203: v124.26,104.55 125.17,103.63 125.98,103.63 U8.35 | v122.63,106.17 122.63,108 122.02,108.61 117.45,108.61 116.74,107.9 116.74,106.58 115.72,105.56 112.06,105.56 110.34,107.29 v107.7,107.29
  Bottom 0.203: v122.63,106.17 v124.26,104.55 | v107.7,107.29 107.7,106.17 106.17,104.65 106.17,90.73 107.29,89.61 J36.P$1
28027_SPISOMIA  (via drill 0.51)
  Top 0.203: v127.61,103.43 127.2,103.02 126.09,103.02 U8.34 | v112.67,104.44 v115.52,104.44
  Bottom 0.203: v127.61,103.43 125.58,103.43 123.85,101.7 118.26,101.7 v115.52,104.44 | v112.67,104.44 112.67,103.33 108.41,99.06 108.41,88.09
  Bottom 0.61: J35.P$1 108.41,88.09
28027_SPISTEA  (via drill 0.51)
  Top 0.203: v124.26,103.23 125.17,102.31 125.98,102.31 U8.33 | v121.01,110.13 112.57,110.13 v112.17,110.54
  Bottom 0.203: v124.26,103.23 124.26,103.43 121.01,106.68 v121.01,110.13 | v112.17,110.54 112.17,110.03 107.39,105.26 107.39,92.15 J37.P$1
+5V  (via drill 0.51)
  Top 0.61: L1.P$61 49.58,102.31 52.02,102.31 J152.P$1 52.32,102.31 54.56,102.31 J152.P$2 54.86,102.31 57.1,102.31 J152.P$3 | L1.P$21 49.58,165.81 52.02,165.81 J103.P$1 52.32,165.81 54.56,165.81 J103.P$2 54.86,165.81 57.1,165.81 J103.P$3 | SV2.3 5.69,53.95 5.69,51.82 SV2.1 5.69,51.51 3.45,51.51 SV2.2 3.15,51.51 3.15,53.95 SV2.4 3.05,54.25 3.05,54.76 1.83,55.98 1.83,100.18 4.78,103.12 v8.33,103.12 | J200.P$1 J200.P$2 17.37,159.92 23.67,159.92 37.8,145.8 37.8,142.65 39.12,141.33 v48.87,141.33 | J203.P$1 J203.P$2 17.37,149.96 19,151.59 v19.71,151.59 | R26.2 2.23,120.7 2.23,123.65 2.03,123.85 S17.P$5 | S17.P$5 2.44,123.85 4.47,123.85 S17.P$4 4.78,123.95 7.01,123.95 S17.P$3 | S17.P$5 1.93,124.16 1.93,126.39 S18.P$5 2.23,126.49 4.47,126.49 S18.P$4 | S18.P$3 7.01,126.39 7.01,124.26 S17.P$3 | S17.P$2 9.55,123.95 7.32,123.95 S17.P$3 | S17.P$2 9.55,124.26 9.55,126.39 S18.P$2 9.75,126.69 9.75,137.36 DCDC5V.3 | S17.P$2 9.86,123.95 12.09,123.95 S17.P$1 12.09,124.26 12.09,126.39 S18.P$1
  Bottom 0.61: 49.58,141.12 49.58,102.31 L1.P$61 | 49.58,141.12 50.8,142.34 50.8,163.98 49.58,165.2 49.58,165.71 L1.P$21 | J203.P$1 14.53,149.86 14.53,142.14 9.86,137.47 DCDC5V.3 | v19.71,151.59 19.71,152.91 17.17,155.45 17.17,160.02 J200.P$2 | v8.33,103.12 8.33,104.14 2.03,110.44 2.03,123.85 S17.P$5 | v48.87,141.33 49.38,141.33 49.58,141.12
A4973EN  (via drill 0.51)
  Top 0.203: v22.35,57.3 23.27,57.3 U1.8 | U5.8 39.83,57.3 v38.81,57.3 38.1,57.3 36.27,55.47 36.27,35.66 33.22,32.61 v33.22,30.68
  Bottom 0.203: v38.81,57.3 v22.35,57.3 | S1.P$2 44.2,14.12 33.93,24.38 33.93,29.97 v33.22,30.68
ADCA0  (via drill 0.51)
  Top 0.203: v122.33,94.49 125.98,94.49 U8.21 | v110.85,100.38 109.83,101.4 v109.63,101.4
  Bottom 0.203: v122.33,94.49 116.74,94.49 v110.85,100.38 | v109.63,101.4 109.63,106.88 114.5,111.76 114.5,115.11 115.52,116.13 SV15.7
ADCA2  (via drill 0.51)
  Top 0.203: v128.32,89.92 126.09,92.15 126.09,93.78 U8.20 | v130.56,110.85 v134.31,110.85
  Bottom 0.203: v128.32,89.92 131.78,89.92 137.47,95.61 137.47,107.19 137.87,107.59 137.87,108.2 135.23,110.85 v134.31,110.85 | v130.56,110.85 123.65,117.75 114.61,117.75 113.08,116.23 SV15.9
ADCA4  (via drill 0.51)
  Top 0.203: v115.62,93.78 117.75,93.78 U8.19 | v103.63,105.16 103.63,108 v103.83,108.2
  Bottom 0.203: v115.62,93.78 107.7,85.85 106.88,85.85 105.87,86.87 105.87,90.02 104.95,90.93 104.34,90.93 103.63,91.64 v103.63,105.16 | v103.83,108.2 104.04,108.2 109.02,113.18 109.02,115.11 108,116.13 SV15.13
ADCA6
  Top 0.203: U8.18 117.75,94.59 113.79,94.59 109.73,98.65 108.2,98.65 102.82,104.04 102.82,112.67 105.26,115.11 105.87,115.11 106.88,116.13 106.88,116.74 107.9,117.75 120.7,117.75 122.12,116.33 122.12,114.71 123.14,113.69 SV15.2
ADCB2  (via drill 0.51)
  Top 0.203: v124.05,97.13 124.66,96.52 125.98,96.52 U8.24 | v121.61,111.76 113.39,111.76 111.56,113.59 111.56,115.11 110.54,116.13 SV15.11
  Bottom 0.203: v124.05,97.13 124.05,97.64 128.83,102.41 128.83,104.55 v121.61,111.76
ADCB4  (via drill 0.51)
  Top 0.203: v124.46,99.16 124.46,97.84 125.17,97.13 125.98,97.13 U8.25 | v122.12,110.13 120.9,111.35 111.25,111.35 109.02,113.59 109.02,114.2 108.41,114.81 v106.78,114.81
  Bottom 0.203: v124.46,99.16 128.42,103.12 128.42,103.83 v122.12,110.13 | v106.78,114.81 105.46,116.13 SV15.15
ADCIN14
  Top 0.203: 49.58,160.73 L1.P$23 | 52.02,160.73 J105.P$1 52.12,160.73 | 54.66,160.73 J105.P$2 54.56,160.73 | 57.1,160.73 J105.P$3
  Top 0.61: 52.02,160.73 49.58,160.73 | 57.1,160.73 54.66,160.73 | 54.56,160.73 52.12,160.73
ADCIN15
  Top 0.203: 49.58,97.23 L1.P$63 | 52.02,97.23 J150.P$1 52.12,97.23 | 54.66,97.23 J150.P$2 54.56,97.23 | 57.1,97.23 J150.P$3
  Top 0.61: 52.02,97.23 49.58,97.23 | 57.1,97.23 54.66,97.23 | 54.56,97.23 52.12,97.23
ADCINA2
  Top 0.203: 49.58,145.49 L1.P$29 | 52.02,145.49 J111.P$1 52.12,145.49 | 54.66,145.49 J111.P$2 54.56,145.49 | 57.1,145.49 J111.P$3
  Top 0.61: 52.02,145.49 49.58,145.49 | 57.1,145.49 54.66,145.49 | 54.56,145.49 52.12,145.49
  Bottom 0.203: SV11.3 141.83,163.88 135.74,157.78 135.74,131.47 126.09,121.82 99.57,121.82 88.49,132.89 81.79,132.89 78.64,136.04 66.55,136.04 57.2,145.39 J111.P$3
ADCINA3
  Top 0.203: 49.58,153.11 L1.P$26 | 52.02,153.11 J108.P$1 52.12,153.11 | 54.66,153.11 J108.P$2 54.56,153.11 | 57.1,153.11 J108.P$3
  Top 0.61: 52.02,153.11 49.58,153.11 | 57.1,153.11 54.66,153.11 | 54.56,153.11 52.12,153.11
  Bottom 0.203: 141.94,165.41 142.95,164.39 142.95,138.07 126.29,121.41 99.36,121.41 88.29,132.49 81.58,132.49 78.44,135.64 65.94,135.64 57.3,144.27 56.69,144.27 56.08,144.88 56.08,151.99 57.1,153.01 J108.P$3 | 141.94,166.42 SV11.4
  Bottom 0.61: 141.94,165.41 141.94,166.42
ADCINA4
  Top 0.203: 49.58,81.99 L1.P$69 | 52.02,81.99 J144.P$1 52.12,81.99 | 54.66,81.99 J144.P$2 54.56,81.99 | 57.1,81.99 J144.P$3
  Top 0.61: 52.02,81.99 49.58,81.99 | 57.1,81.99 54.66,81.99 | 54.56,81.99 52.12,81.99
ADCINA5
  Top 0.203: 49.58,89.61 L1.P$66 | 52.02,89.61 J147.P$1 52.12,89.61 | 54.66,89.61 J147.P$2 54.56,89.61 | 57.1,89.61 J147.P$3
  Top 0.61: 52.02,89.61 49.58,89.61 | 57.1,89.61 54.66,89.61 | 54.56,89.61 52.12,89.61
ADCINB2
  Top 0.203: 49.58,148.03 L1.P$28 | 52.02,148.03 J110.P$1 52.12,148.03 | 54.66,148.03 J110.P$2 54.56,148.03 | 57.1,148.03 J110.P$3
  Top 0.61: 52.02,148.03 49.58,148.03 | 57.1,148.03 54.66,148.03 | 54.56,148.03 52.12,148.03
ADCINB3
  Top 0.203: 49.58,155.65 L1.P$25 | 52.02,155.65 J107.P$1 52.12,155.65 | 54.66,155.65 J107.P$2 54.56,155.65 | 57.1,155.65 J107.P$3
  Top 0.61: 52.02,155.65 49.58,155.65 | 57.1,155.65 54.66,155.65 | 54.56,155.65 52.12,155.65
ADCINB4
  Top 0.203: 49.58,84.53 L1.P$68 | 52.02,84.53 J145.P$1 52.12,84.53 | 54.66,84.53 J145.P$2 54.56,84.53 | 57.1,84.53 J145.P$3 57.2,84.53 85.04,112.37 101.7,112.37 SV12.4
  Top 0.61: 52.02,84.53 49.58,84.53 | 57.1,84.53 54.66,84.53 | 54.56,84.53 52.12,84.53
ADCINB5
  Top 0.203: 49.58,92.15 L1.P$65 | 52.02,92.15 J148.P$1 52.12,92.15 | 54.66,92.15 J148.P$2 54.56,92.15 | 57.1,92.15 J148.P$3
  Top 0.61: 52.02,92.15 49.58,92.15 | 57.1,92.15 54.66,92.15 | 54.56,92.15 52.12,92.15
ADCINC2
  Top 0.203: 49.58,150.57 L1.P$27 | 52.02,150.57 J109.P$1 52.12,150.57 | 54.66,150.57 J109.P$2 54.56,150.57 | 57.1,150.57 J109.P$3
  Top 0.61: 52.02,150.57 49.58,150.57 | 57.1,150.57 54.66,150.57 | 54.56,150.57 52.12,150.57
ADCINC3
  Top 0.203: 49.58,158.19 L1.P$24 | 52.02,158.19 J106.P$1 52.12,158.19 | 54.66,158.19 J106.P$2 54.56,158.19 | 57.1,158.19 J106.P$3
  Top 0.61: 52.02,158.19 49.58,158.19 | 57.1,158.19 54.66,158.19 | 54.56,158.19 52.12,158.19
ADCINC4
  Top 0.203: 49.58,87.07 L1.P$67 | 52.02,87.07 J146.P$1 52.12,87.07 | 54.66,87.07 J146.P$2 54.56,87.07 | 57.1,87.07 J146.P$3
  Top 0.61: 52.02,87.07 49.58,87.07 | 57.1,87.07 54.66,87.07 | 54.56,87.07 52.12,87.07
ADCINC5
  Top 0.203: 49.58,94.69 L1.P$64 | 52.02,94.69 J149.P$1 52.12,94.69 | 54.66,94.69 J149.P$2 54.56,94.69 | 57.1,94.69 J149.P$3
  Top 0.61: 52.02,94.69 49.58,94.69 | 57.1,94.69 54.66,94.69 | 54.56,94.69 52.12,94.69
DACOUTA
  Top 0.203: 49.58,142.95 L1.P$30 | 52.02,142.95 J112.P$1 52.12,142.95 | 54.66,142.95 J112.P$2 54.56,142.95 | 57.1,142.95 J112.P$3
  Top 0.61: 52.02,142.95 49.58,142.95 | 57.1,142.95 54.66,142.95 | 54.56,142.95 52.12,142.95
DACOUTB
  Top 0.203: 49.58,79.45 L1.P$70 | 52.02,79.45 J143.P$1 52.12,79.45 | 54.66,79.45 J143.P$2 54.56,79.45 | 57.1,79.45 J143.P$3
  Top 0.61: 52.02,79.45 49.58,79.45 | 57.1,79.45 54.66,79.45 | 54.56,79.45 52.12,79.45
DRV1_DIR  (via drill 0.51)
  Top 0.203: v90.83,11.68 93.57,8.94 95.61,8.94 95.91,9.25 95.91,10.57 U2.P$2 | v91.03,17.27 88.39,17.27 85.95,19.71 85.95,29.77 86.77,30.58 J80.P$1 86.87,30.68 | 89.31,30.68 J80.P$2
  Top 0.61: 86.87,30.68 89.31,30.68
  Bottom 0.203: v90.83,11.68 90.83,13.11 91.03,13.31 v91.03,17.27
DRV1_M+
  Top 0.356: U2.P$8 99.91,9.31 100.33,9.53
  Top 0.762: 100.33,9.53 100.33,9.68
  Top 1.016: 100.33,9.68 109.38,9.68 SV7.1 SV7.3 SV7.5
DRV1_M-
  Top 0.356: U2.P$10 99.26,19.25 99.54,19.53
  Top 1.016: 99.54,19.53 102.55,19.37 105.41,16.51 SV7.6 SV7.4 SV7.2
DRV1_PWM  (via drill 0.51)
  Top 0.203: v94.28,11.68 95.3,10.67 U2.P$1 | v93.37,16.46 88.59,16.46 85.55,19.51 85.55,31.9 86.77,33.12 J79.P$1 86.87,33.22 | 89.31,33.22 J79.P$2
  Top 0.61: 86.87,33.22 89.31,33.22
  Bottom 0.203: v94.28,11.68 94.28,15.54 v93.37,16.46
DRV2_DIR
  Top 0.203: 64.36,31.65 64.41,31.7 64.41,33.63 63.7,34.34 62.99,34.34 62.18,33.53 62.18,33.02 61.27,32.11 60.76,32.11 59.64,30.99 59.64,30.48 45.31,16.15 45.31,11.18 46.13,10.36 46.13,4.37 47.65,2.85 50.8,2.85 56.9,8.94 63.6,8.94 63.91,9.25 63.91,10.57 U4.P$2 | 63.4,30.68 J83.P$1 | 65.33,30.68 65.84,30.68 J83.P$2
  Top 0.61: 63.4,30.68 64.36,31.65 65.33,30.68
DRV2_M+
  Top 0.356: U4.P$8 67.84,9.47 68.26,9.37
  Top 1.016: 68.26,9.37 77.47,9.37 77.47,11.27 SV8.1 SV8.3 SV8.5
DRV2_M-
  Top 0.356: U4.P$10 67.19,19.09 67.63,19.53
  Top 1.016: 67.63,19.53 71.75,19.53 SV8.6 SV8.4 SV8.2
DRV2_PWM
  Top 0.203: U4.P$1 63.2,10.57 57.91,10.57 50.6,3.25 49.78,3.25 48.67,4.37 48.67,8.43 45.72,11.38 45.72,14.02 62.18,30.48 62.18,32 63.3,33.12 J82.P$1
  Bottom 0.203: 65.84,33.22 J82.P$2 | 63.4,33.22 J82.P$1
  Bottom 0.61: 63.4,33.22 65.84,33.22
GND  (via drill 0.51)
  Top 0.356: U2.P$16 95.36,13.97 U2.P$17 | U2.P$15 96.01,13.97 U2.P$17 | U2.P$9 99.91,13.97 U2.P$17 | U2.P$7 99.26,13.97 U2.P$17 | U4.P$16 63.29,14.18 63.5,13.97 | U4.P$15 63.94,14.17 64.14,13.97 | U4.P$9 67.84,14.08 67.94,13.97 | U4.P$7 67.19,13.93 67.15,13.97 | U8.23 121.31,95.8 121.1,95.8 121.1,98.39 | 121.1,98.39 121.1,104.25 | 121.1,104.25 121.1,104.89 | 121.1,104.89 C11.2 | U8.12 121.1,98.39 | U8.2 121.1,104.89 | U8.3 121.1,104.25
  Top 0.61: TRIMPOT2.5 57.4,2.74 59.84,2.74 TRIMPOT2.6 | 50.19,11.79 50.7,11.79 51.82,12.9 v53.34,13.81 | 50.19,11.79 46.74,11.79 S1.P$1 | 50.19,11.79 50.19,4.37 S159.P$1 | C25.- 56.9,14.12 C28.- | J124.P$2 83.82,62.48 81.28,62.48 J124.P$1 81.08,62.18 76.71,62.18 74.88,60.35 74.88,21.54 | J124.P$3 86.36,62.48 88.9,62.48 U$1.2 | TRIMPOT1.6 TRIMPOT1.5 89,2.74 89,3.45 87.88,4.57 87.88,14.05 | 74.88,21.54 78.23,21.54 84.84,14.94 v86.36,13.97 84.94,12.9 75.59,3.56 R43.2 | 74.88,21.54 71.02,21.54 C22.2 | v103.63,20.02 103.02,20.62 103.02,21.54 C16.2 | v102.72,8.43 107.59,3.56 R41.2 | 44.4,57.3 44.91,57.3 U5.4 | 44.4,57.3 43.69,57.3 U5.5 43.79,57.61 43.79,60.15 C2.2 43.59,60.35 43.59,62.79 R7.1 | U5.11 42.47,48.16 43.59,48.16 U5.12 43.89,48.16 44.91,48.16 U5.13 | JP3.2 38,52.02 39.32,52.02 42.47,48.87 42.47,48.46 U5.11 | C1.- 42.27,39.42 42.27,43.79 42.16,43.89 42.16,47.95 U5.11 | v44.4,55.58 44.4,57.3 | 27.74,57.3 28.35,57.3 U1.4 | 27.74,57.3 27.23,57.3 U1.5 27.03,57 27.03,56.19 22.86,52.02 | R3.1 27.64,62.79 27.64,60.35 C14.2 27.74,60.05 27.74,57.3 | SV4.10 8.33,61.67 10.77,61.67 SV4.9 10.77,61.98 10.77,62.28 12.09,63.6 12.09,80.57 10.97,81.69 SV4.25 10.77,81.99 8.33,81.99 SV4.26 | U1.13 28.35,48.16 27.43,48.16 U1.12 27.13,48.16 25.91,48.16 U1.11 25.91,48.46 25.91,48.97 23.98,50.9 | 22.86,52.02 21.44,52.02 JP2.2 | 23.98,50.9 22.86,52.02 | 25.7,41.45 25.7,42.57 22.45,45.82 22.45,49.38 23.98,50.9 | 25.7,41.45 25.7,39.42 C13.- | v25.81,41.45 25.7,41.45 | S137.P$5 S137.P$4 S137.P$3 | DCDC5V.2 7.21,137.47 7.21,147.12 7.01,147.32 S137.P$3 | S137.P$3 S137.P$2 S137.P$1 12.09,147.32 23.27,136.14
  Top 0.61: S129.P$5 S129.P$4 S129.P$3 S129.P$2 S129.P$1 | 23.27,136.14 25.5,136.14 26.72,137.36 27.03,137.36 DCDC3.3V.2 | SV2.30 3.25,87.07 5.69,87.07 SV2.29 | SV2.34 3.25,92.15 5.69,92.15 SV2.33 | SV2.20 3.25,74.37 5.69,74.37 SV2.19 | SV2.6 3.25,56.59 5.69,56.59 SV2.5 | SV2.14 3.25,66.75 5.69,66.75 SV2.13 | SV4.40 8.33,99.77 10.77,99.77 SV4.39 | POWER.1 4.67,105.46 7.01,105.46 8.94,107.39 J5.2 8.94,107.7 8.94,109.22 6.4,111.76 J5.3 5.99,111.96 6.2,111.96 11.99,117.75 13.01,117.75 5V.C | C3.2 28.85,116.53 28.85,111.05 27.43,109.63 26.62,109.63 U6.P$4 26.31,109.63 23.16,109.63 14.94,117.86 5V.C | 5V.C 13.31,120.5 3V3.C 13.41,120.8 13.41,122.22 23.06,131.88 23.06,135.94 23.27,136.14 | 23.67,179.12 25.91,179.12 28.35,176.68 G1.- | 23.67,179.12 13.41,179.12 12.39,178.1 12.39,177.19 U3.4 | 83.92,189.99 92.05,189.99 C6.2 92.35,189.89 98.35,189.89 v107.09,181.15 | 83.92,189.99 82.6,191.31 82.6,192.94 IC1.7 | v82.6,182.57 82.6,180.24 IC2.7 | v83.72,189.79 83.92,189.99 | T1.3 7.32,194.36 10.77,194.36 12.9,196.49 16.56,196.49 18.49,194.56 18.49,194.36 T2.3 18.69,194.77 23.67,194.77 | L1.P$22 49.58,163.27 52.02,163.27 J104.P$1 52.32,163.27 54.56,163.27 J104.P$2 54.86,163.27 57.1,163.27 J104.P$3 | 50.7,194.46 38.61,194.46 36.98,196.09 30.07,196.09 28.85,194.87 SV13.2 28.55,194.77 23.67,194.77 | 50.7,194.46 52.53,194.46 C4.2 | 49.89,187.35 49.07,187.35 U7.4 | v50.7,188.16 49.89,187.35 | v50.7,194.26 50.7,194.46 | v50.8,183.08 50.8,183.29 51.31,183.79 51.31,185.93 49.89,187.35 | 23.67,194.77 23.67,179.12 | L1.P$20 92.76,165.81 95.2,165.81 J102.P$1 95.5,165.81 97.74,165.81 J102.P$2 98.04,165.81 100.28,165.81 J102.P$3
  Top 0.61: C9.2 92.15,177.29 106.17,177.29 J7.P$2 108.81,174.35 108.81,172.11 J7.P$1 | J76.P$2 138.58,180.24 141.02,180.24 J76.P$1 | J74.P$2 138.58,185.32 141.02,185.32 J74.P$1 | J76.P$1 141.02,180.54 141.02,185.01 J74.P$1 | J72.P$1 141.02,190.4 138.58,190.4 J72.P$2 138.28,190.5 137.06,191.72 127.91,191.72 126.9,190.7 116.33,190.7 B1.P$2 | J70.P$2 138.58,195.48 141.02,195.48 J70.P$1 141.02,195.17 141.02,190.7 J72.P$1 | J74.P$1 141.02,185.62 141.02,190.09 J72.P$1 | SV6.3 118.77,133.91 121.21,133.91 SV6.4 121.21,134.21 121.21,134.52 123.14,136.45 123.14,139.7 123.95,140.51 133.3,140.51 ETH1.P$2 ETH1.P$1 v137.16,123.95 | J76.P$1 141.22,179.93 141.22,172.11 143.15,170.18 143.15,160.12 141.94,158.9 SV11.1 | C10.2 91.44,128.73 92.86,127.31 92.86,125.17 91.95,124.26 81.38,124.26 81.08,124.56 | 81.08,124.56 81.08,130.86 81.89,131.67 81.89,131.98 IC3.7 | L1.P$62 49.58,99.77 52.02,99.77 J151.P$1 52.32,99.77 54.56,99.77 J151.P$2 54.86,99.77 57.1,99.77 J151.P$3 57.1,100.08 57.1,100.38 64.11,107.39 64.11,123.65 B2.P$2 | v80.67,124.36 80.87,124.36 81.08,124.56 | S20.P$1 141.63,30.48 141.63,33.02 S20.P$2 141.63,33.22 141.63,35.56 S20.P$3 141.63,35.76 141.63,38.1 S20.P$4 141.63,38.3 141.63,40.64 S20.P$5 141.63,40.84 141.63,43.18 S20.P$6 141.63,43.38 141.63,45.72 S20.P$7 141.63,45.92 141.63,48.26 S20.P$8 141.63,48.46 141.63,50.8 S20.P$9 141.63,51 141.63,53.34 S20.P$10 141.63,53.54 141.63,55.88 S24.P$1 141.63,56.08 141.63,58.42 S24.P$2 141.63,58.62 141.63,60.96 S24.P$3 141.63,61.16 141.63,63.5 S24.P$4 141.63,63.7 141.63,66.04 S24.P$5 141.63,66.24 141.63,68.58 S24.P$6 141.63,68.78 141.63,71.12 S24.P$7 141.63,71.32 141.63,73.66 S24.P$8 141.63,73.86 141.63,76 S24.P$9 141.63,76.2 141.63,78.54 S24.P$10 140.82,78.74 135.64,83.92
  Top 0.61: C5.2 139.29,96.52 v138.28,97.54 | SV14.8 139.4,107.39 139.4,109.83 SV14.10 139.4,110.13 139.4,112.06 SV14.12 139.29,112.37 139.19,112.27 137.16,112.27 | 137.16,112.27 135.64,112.27 R32.2 135.33,112.37 134.11,112.37 130.35,116.13 123.24,116.13 SV15.1 | 137.16,112.27 ETH1.P$12 | v106.38,106.17 C18.2 | L1.P$60 92.76,102.31 95.2,102.31 J153.P$1 95.5,102.31 97.54,102.31 J153.P$2 97.84,102.31 100.08,102.31 J153.P$3 100.38,102.21 105.56,97.03 C8.2 109.32,96.72 109.32,89.41 114.81,83.92 123.65,83.92 124.66,84.94 P1.2 | 121.31,95.8 121.31,94.08 124.77,90.63 124.77,85.45 P1.2 | C7.2 134.62,84.94 135.64,83.92 | 135.64,83.92 133.3,81.58 128.42,81.58 124.87,85.14 P1.2
  Top 3.302: C20.- 99.82,14.05 99.91,13.97
  Top 3.556: v86.36,13.97 86.44,14.05 87.88,14.05 C20.- | v53.34,13.81 53.34,13.89 C28.- 56.83,13.97 63.5,13.97 64.14,13.97 U4.P$17 67.15,13.97 67.94,13.97
  Bottom 0.61: TRIMPOT2.5 57.3,2.74 51.71,2.74 50.19,4.27 S159.P$1 | J124.P$2 83.82,62.48 86.36,62.48 J124.P$3 | v103.63,20.02 97.64,14.02 U2.P$17 97.74,13.72 102.72,8.74 v102.72,8.43 | U4.P$17 65.63,14.02 72.95,14.02 74.17,15.24 84.53,15.24 84.84,14.94 v86.36,13.97 | C15.- 42.27,39.62 42.27,43.38 38,47.65 38,52.02 JP3.2 | v44.4,55.58 41.55,55.58 38.2,52.22 JP3.2 | v25.81,41.45 25.81,39.62 C12.- 26.01,39.32 34.54,30.79 34.54,24.69 46.74,12.5 S1.P$1 | SV4.9 10.87,61.57 11.89,61.57 21.34,52.12 JP2.2 21.74,52.02 37.69,52.02 JP3.2 | 12.09,81.99 21.64,81.99 26.21,86.56 B3.P$1 | 12.09,81.99 10.87,81.99 SV4.25 | S129.P$1 13.92,157.48 18.69,152.71 18.69,150.57 | 18.69,150.57 18.69,147.01 26.82,138.89 26.82,137.67 27.03,137.47 DCDC3.3V.2 | SV2.6 3.15,56.59 3.15,57.2 1.83,58.52 1.83,65.33 SV2.14 3.05,66.95 1.83,68.17 1.83,72.24 3.15,73.56 3.15,74.27 SV2.20 3.05,74.57 1.83,75.79 1.83,84.94 3.05,86.16 3.05,86.77 SV2.30 3.15,87.07 3.15,87.68 1.83,89 1.83,90.73 SV2.34 3.05,92.35 3.05,92.86 1.83,94.08 1.83,100.28 5.79,104.24 | 5.79,104.24 4.67,105.36 POWER.1 | 5.79,104.24 8.23,101.8 8.23,99.77 SV4.40 | 12.09,81.99 12.09,98.45 10.87,99.67 SV4.39 | 82.6,187.96 82.6,188.67 v83.72,189.79 | 82.6,187.96 v82.6,182.57 | v50.7,194.26 v50.7,188.16 50.9,187.96 82.6,187.96 | v50.8,183.08 50.8,165.2 52.02,163.98 52.02,163.27 J104.P$1 | B1.P$2 116.33,188.37 108.92,180.95 | 108.92,180.95 108.92,174.65 J7.P$2 | J7.P$1 110.13,170.79 110.13,166.42 109.42,165.71 100.38,165.71 J102.P$3 | ETH1.P$1 141.83,143.87 141.83,158.8 SV11.1 | B2.P$2 64.21,123.75 64.82,124.36 v80.67,124.36 80.87,124.16 80.87,112.27 89.61,103.53 91.44,103.53 92.66,102.31 L1.P$60
  Bottom 0.61: SV14.8 139.29,107.29 138.07,106.07 138.07,104.24 139.29,103.02 139.29,102.51 SV14.4 139.29,102.21 138.07,100.99 138.07,99.16 138.28,98.96 v138.28,97.54 138.07,97.33 138.07,95.3 128.22,85.45 124.87,85.45 P1.2 | v106.38,106.17 103.12,106.17 SV12.1 101.6,104.55 101.6,103.53 100.38,102.31 J153.P$3 | ETH1.P$12 v137.16,123.95 | v107.09,181.15 108.71,181.15 108.92,180.95 | 18.69,150.57 20.12,150.57 20.73,151.18 20.73,153.52 18.49,155.75 18.49,163.07 17.17,164.39 14.73,164.39 13.92,165.2 13.92,166.22 24.28,176.58 28.35,176.58 G1.-
  Bottom 3.556: C27.- 88.83,13.97 v86.36,13.97 | v53.34,13.81 56.83,13.81 C28.-
  pour Top: 0,0 0,198.12 144.78,198.12 144.78,0
  pour Bottom: 0,0 0,198.12 144.78,198.12 144.78,0
GPIO0
  Top 0.203: 123.85,128.83 J11.P$1 | 126.29,128.83 J11.P$2 | 82.6,165.81 J122.P$1 | 85.04,165.81 J122.P$2 85.14,165.81 | 87.68,165.81 J122.P$3 87.58,165.81 | 90.12,165.81 L1.P$40
  Top 0.61: 126.29,128.83 123.85,128.83 | 85.04,165.81 82.6,165.81 | 90.12,165.81 87.68,165.81 | 87.58,165.81 85.14,165.81
  Bottom 0.203: 91.34,164.59 100.48,164.59 111.96,153.11 125.07,153.11 130.66,147.52 130.66,137.57 123.85,130.76 123.85,128.83 J11.P$1 | 90.22,165.71 L1.P$40
  Bottom 0.61: 90.22,165.71 91.34,164.59
GPIO1
  Top 0.203: 87.68,163.27 J121.P$3 87.58,163.27 | 90.12,163.27 L1.P$39 | 82.6,163.27 J121.P$1 | 85.04,163.27 J121.P$2 85.14,163.27
  Top 0.61: 90.12,163.27 87.68,163.27 | 85.04,163.27 82.6,163.27 | 85.14,163.27 87.58,163.27
  Bottom 0.203: 34.95,192.23 42.16,185.01 58.22,185.01 79.96,163.27 82.5,163.27 J121.P$1 | 33.93,192.23 SV13.5
  Bottom 0.61: 34.95,192.23 33.93,192.23
GPIO2  (via drill 0.51)
  Top 0.203: 87.68,160.73 J120.P$3 87.58,160.73 | 90.12,160.73 L1.P$38 | 9.14,41.76 J198.P$1 | J198.P$2 | 82.6,160.73 J120.P$1 | 85.04,160.73 J120.P$2 85.14,160.73 | v41.55,103.73 43.79,103.73 58.01,117.96 58.01,134.93 v76.61,153.52
  Top 0.61: 90.12,160.73 87.68,160.73 | J198.P$2 9.14,41.76 | 85.04,160.73 82.6,160.73 | 85.14,160.73 87.58,160.73
  Bottom 0.203: 9.14,42.88 10.16,43.89 10.16,50.09 9.65,50.6 9.65,61.98 10.67,62.99 24.59,62.99 40.84,79.25 40.84,103.02 v41.55,103.73 | v76.61,153.52 76.61,155.75 80.57,159.72 81.58,159.72 82.5,160.63 J120.P$1 | 9.14,41.76 J198.P$1
  Bottom 0.61: 9.14,42.88 9.14,41.76
GPIO3  (via drill 0.51)
  Top 0.203: 87.68,158.19 J119.P$3 87.58,158.19 | 90.12,158.19 L1.P$37 | 9.14,44.3 J199.P$1 | J199.P$2 11.68,44.3 | 82.6,158.19 J119.P$1 | 85.04,158.19 J119.P$2 85.14,158.19 | 11.68,45.41 13.01,46.74 13.01,51.82 37.49,76.3 37.49,101.91 48.67,113.08 52.53,113.08 57.61,118.16 57.61,135.64 v77.42,155.45
  Top 0.61: 90.12,158.19 87.68,158.19 | J199.P$2 9.14,44.3 | 85.04,158.19 82.6,158.19 | 11.68,45.41 11.68,44.3 | 85.14,158.19 87.58,158.19
  Bottom 0.203: 79.86,155.45 v77.42,155.45 | 82.5,158.09 J119.P$1
  Bottom 0.61: 82.5,158.09 79.86,155.45
GPIO4  (via drill 0.51)
  Top 0.203: 128.42,195.48 J71.P$2 | 130.86,195.48 J71.P$1 | 82.6,155.65 J118.P$1 | 85.04,155.65 J118.P$2 85.14,155.65 | 87.68,155.65 J118.P$3 87.58,155.65 | 90.12,155.65 L1.P$36 | v102.51,157.89 v108.31,157.89
  Top 0.61: 130.86,195.48 128.42,195.48 | 85.04,155.65 82.6,155.65 | 90.12,155.65 87.68,155.65 | 87.58,155.65 85.14,155.65
  Bottom 0.203: 130.96,191.92 132.08,190.81 132.08,175.06 114.71,157.68 108.51,157.68 v108.31,157.89 | v102.51,157.89 101.7,157.89 100.48,156.67 91.24,156.67 | 130.96,195.38 J71.P$1 | 90.22,155.65 L1.P$36
  Bottom 0.61: 130.96,191.92 130.96,195.38 | 90.22,155.65 91.24,156.67
GPIO5
  Top 0.203: 128.42,190.4 J73.P$2 | 130.86,190.4 J73.P$1 | 82.6,153.11 J117.P$1 | 85.04,153.11 J117.P$2 85.14,153.11 | 87.68,153.11 J117.P$3 87.58,153.11 | 90.12,153.11 L1.P$35
  Top 0.61: 130.86,190.4 128.42,190.4 | 85.04,153.11 82.6,153.11 | 90.12,153.11 87.68,153.11 | 87.58,153.11 85.14,153.11
  Bottom 0.203: 118.97,190.4 117.04,192.33 104.24,192.33 88.39,176.48 88.39,175.36 80.26,167.23 80.26,165.61 81.58,164.29 83.01,164.29 84.02,163.27 84.02,157.58 84.94,156.67 85.55,156.67 86.56,155.65 86.56,154.13 87.58,153.11 J117.P$3 | 128.32,190.4 J73.P$2
  Bottom 0.61: 118.97,190.4 128.32,190.4
GPIO6  (via drill 0.51)
  Top 0.203: 128.42,185.32 J75.P$2 | 130.86,185.32 J75.P$1 | 82.6,102.31 J133.P$1 | 85.04,102.31 J133.P$2 85.14,102.31 | 87.68,102.31 J133.P$3 87.58,102.31 | 90.12,102.31 L1.P$80 90.12,102.41 v95.5,107.8 | v113.89,158.5 113.89,156.57 110.74,153.42 v110.74,150.67 | v99.16,139.09 99.16,122.83 v95.5,119.18